# EAGLE design turbidity-detect-v0.1 (EAGLE 7.2.0)
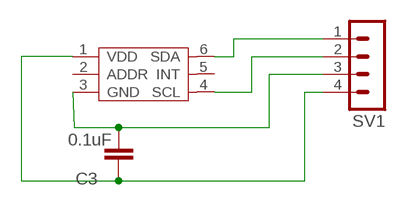
[diagram p0: schematic, sheet 1]

## Parts
C3  0.1uF  CAP0603-CAP  [0603-CAP]
SV1  MA04-1  [MA04-1]
U1  TSL2561T  [TMB-6]

## Nets
GND: C3.1 SV1.3 U1.3(GND)
N$1: SV1.1 U1.6(SDA)
N$2: SV1.2 U1.4(SCL)
VDD: C3.2 SV1.4 U1.1(VDD)
Unconnected: U1.2(ADDR) U1.5(INT)

## Library data of the parts
C3 = SparkFun:CAP: Capacitor Standard 0603 ceramic capacitor, and 0.1" leaded capacitor.
SV1 = con-lstb:MA04-1: PIN HEADER; OC_FARNELL: unknown; OC_NEWARK: unknown
U1 = TSL2561:TSL2561

## Board
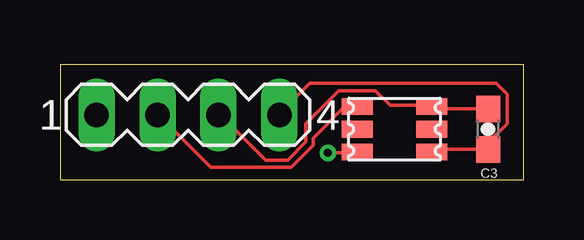
[diagram p1: board, top side]
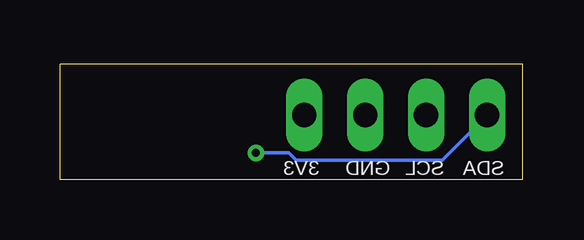
[diagram p2: board, bottom side, seen from below]

Size 19.29 x 4.8 mm. Coordinates in mm from the lower left corner, seen from the top.
Outline: 0,0 0,4.8 19.29,4.8 19.29,0 0,0
Copper layers (1*16): Top 0.0356mm / dielectric 1.5011mm / Bottom 0.0356mm
Design rules "LaenPCBOrder": minimum track width 6mil, minimum drill 13mil, track to track 6mil, track to pad 6mil, pad to pad 6mil, via to via 6mil, smd to smd 6mil, copper to edge 15mil, drill to drill 6mil, minimum pad ring 7mil, minimum via ring 7mil, stop-mask expansion 3mil, vias tented up to drill 0mil, thermal gap 10mil

### Footprints (pad centres in the part's own frame; a part is rotated, then mirrored left to right if it is on the bottom)
0603-CAP = smd 1.1 x 1: 1 -0.85,0; 2 0.85,0
MA04-1 = drill 1.016 long: 1 -3.81,0; 2 -1.27,0; 3 1.27,0; 4 3.81,0
TMB-6 = smd 1.3 x 0.7: 1 -1.55,0.95; 2 -1.55,0; 3 -1.55,-0.95; 4 1.55,-0.95; 5 1.55,0; 6 1.55,0.95

### Placement (x,y rotation side)
C3  17.8,2.1 270 top
SV1  5.3,2.7 0 top
U1  13.9,2.1 180 top

### Tracks (layer width: path | path; a pad name or v marks a point on that pad's centre or on a via)
GND
  Top 0.152: C3.1 17.68,2.95 15.54,2.95 U1.3 15.39,3.1 13.72,3.1 13.11,3.71 11.58,3.71 10.21,2.34 10.21,1.58 9.45,0.81 8.53,0.81 6.71,2.64 SV1.3
N$1  (via drill 0.33)
  Top 0.152: v11.12,1.12 12.34,1.12 U1.6
  Bottom 0.152: v11.12,1.12 9.75,1.12 9.45,0.81 3.35,0.81 1.52,2.64 SV1.1
N$2
  Top 0.152: U1.4 12.34,2.95 11.73,2.95 10.52,1.73 10.52,1.42 9.6,0.51 6.25,0.51 4.12,2.64 SV1.2
VDD
  Top 0.152: U1.1 15.54,1.27 17.68,1.27 C3.2 17.83,1.27 17.83,1.58 18.59,2.34 18.59,3.56 18.14,4.02 10.36,4.02 9.14,2.8 SV1.4

### Text on the board
bPlace: SDA | SCL | GND | 3V3